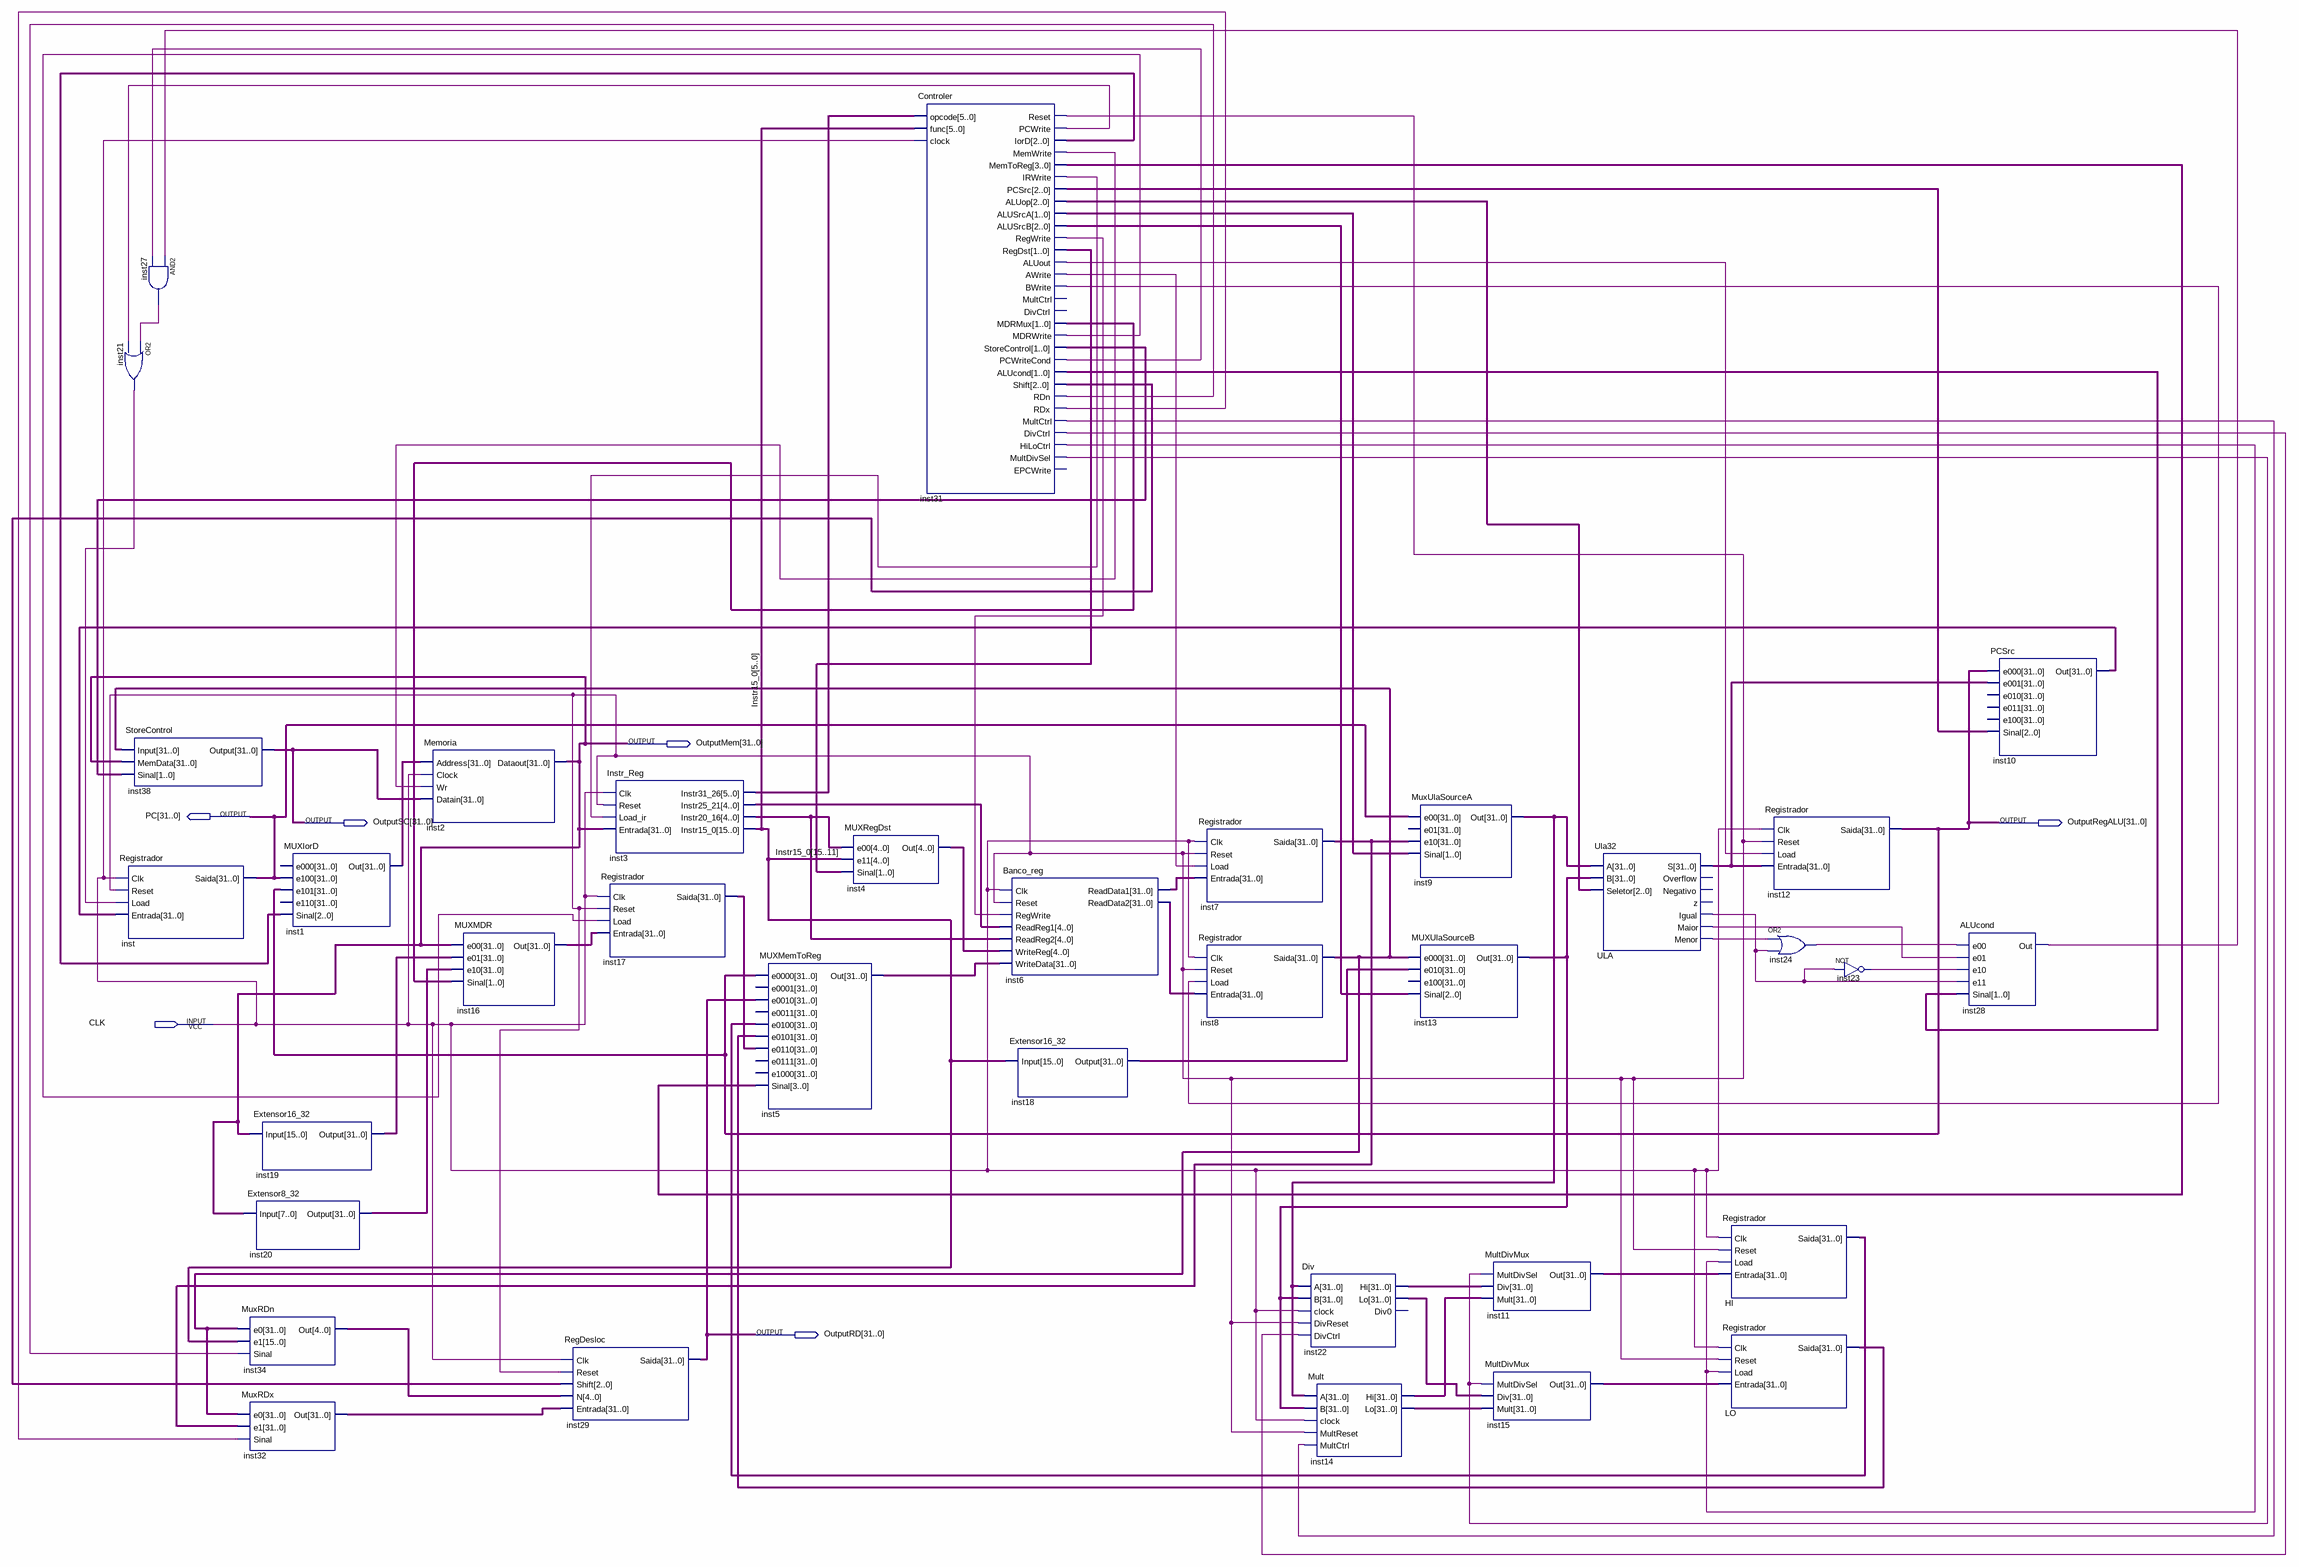
[diagram p0: schematic sheet]
// Quartus schematic HW.bdf as structural Verilog: 35 symbols, 6 pins
module HW (
  input  CLK,
  output [31:0] OutputMem,
  output [31:0] PC,
  output [31:0] OutputSC,
  output [31:0] OutputRegALU,
  output [31:0] OutputRD
);

  wire inst21_out, inst23_out, inst24_out, inst27_out, inst28_out, inst31_aluout, inst31_awrite,
       inst31_bwrite, inst31_divctrl, inst31_hiloctrl, inst31_irwrite, inst31_mdrwrite, inst31_memwrite,
       inst31_multctrl, inst31_multdivsel, inst31_pcwrite, inst31_pcwritecond, inst31_rdn, inst31_rdx,
       inst31_regwrite, inst31_reset, ULA_igual, ULA_maior, ULA_menor;
  wire [1:0] inst31_alucond, inst31_alusrca, inst31_mdrmux, inst31_regdst, inst31_storecontrol;
  wire [2:0] inst31_aluop, inst31_alusrcb, inst31_iord, inst31_pcsrc, inst31_shift;
  wire [3:0] inst31_memtoreg;
  wire [4:0] inst3_instr20_16, inst3_instr25_21, inst4_out, inst34_out;
  wire [5:0] inst3_instr31_26;
  wire [15:0] Instr15_0;
  wire [31:0] HI_saida, inst1_out, inst5_out, inst6_readdata1, inst6_readdata2, inst7_saida, inst8_saida,
       inst9_out, inst10_out, inst11_out, inst13_out, inst14_hi, inst14_lo, inst15_out, inst16_out,
       inst17_saida, inst18_output, inst19_output, inst20_output, inst22_hi, inst22_lo, inst32_out, LO_saida,
       ULA_s;

  or inst21 (inst21_out, inst27_out, inst31_pcwrite);
  Registrador inst (.Clk(CLK), .Reset(inst31_reset), .Load(inst21_out), .Entrada(inst10_out), .Saida(PC));
  and inst27 (inst27_out, inst28_out, inst31_pcwritecond);
  StoreControl inst38 (.Input(inst8_saida), .MemData(OutputMem), .Sinal(inst31_storecontrol), .Output(OutputSC));
  Extensor16_32 inst19 (.Input(OutputMem[15:0]), .Output(inst19_output));
  Extensor8_32 inst20 (.Input(OutputMem[7:0]), .Output(inst20_output));
  MuxRDn inst34 (.e0(inst8_saida), .e1(Instr15_0), .Sinal(inst31_rdn), .Out(inst34_out));
  MuxRDx inst32 (.e0(inst8_saida), .e1(inst7_saida), .Sinal(inst31_rdx), .Out(inst32_out));
  MUXIorD inst1 (.e100(PC), .e101(OutputRegALU), .Sinal(inst31_iord), .Out(inst1_out));  // open: e000, e110
  Memoria inst2 (.Address(inst1_out), .Clock(CLK), .Wr(inst31_memwrite), .Datain(OutputSC), .Dataout(OutputMem));
  MUXMDR inst16 (.e00(OutputMem), .e01(inst19_output), .e10(inst20_output), .Sinal(inst31_mdrmux), .Out(inst16_out));
  Instr_Reg inst3 (
    .Clk(CLK), .Reset(inst31_reset), .Load_ir(inst31_irwrite), .Entrada(OutputMem),
    .Instr31_26(inst3_instr31_26), .Instr25_21(inst3_instr25_21), .Instr20_16(inst3_instr20_16),
    .Instr15_0(Instr15_0));
  Registrador inst17 (
    .Clk(CLK), .Reset(inst31_reset), .Load(inst31_mdrwrite), .Entrada(inst16_out), .Saida(inst17_saida));
  RegDesloc inst29 (
    .Clk(CLK), .Reset(inst31_reset), .Shift(inst31_shift), .N(inst34_out), .Entrada(inst32_out),
    .Saida(OutputRD));
  MUXMemToReg inst5 (
    .e0000(OutputRegALU), .e0010(OutputRD), .e0100(HI_saida), .e0101(LO_saida), .e0110(inst17_saida),
    .Sinal(inst31_memtoreg), .Out(inst5_out));  // open: e0001, e0011, e0111, e1000
  MUXRegDst inst4 (.e00(inst3_instr20_16), .e11(Instr15_0[15:11]), .Sinal(inst31_regdst), .Out(inst4_out));
  Controler inst31 (
    .opcode(inst3_instr31_26), .func(Instr15_0[5:0]), .clock(CLK), .Reset(inst31_reset),
    .PCWrite(inst31_pcwrite), .IorD(inst31_iord), .MemWrite(inst31_memwrite), .MemToReg(inst31_memtoreg),
    .IRWrite(inst31_irwrite), .PCSrc(inst31_pcsrc), .ALUop(inst31_aluop), .ALUSrcA(inst31_alusrca),
    .ALUSrcB(inst31_alusrcb), .RegWrite(inst31_regwrite), .RegDst(inst31_regdst), .ALUout(inst31_aluout),
    .AWrite(inst31_awrite), .BWrite(inst31_bwrite), .MultCtrl({1'bz, inst31_multctrl}),
    .DivCtrl({1'bz, inst31_divctrl}), .MDRMux(inst31_mdrmux), .MDRWrite(inst31_mdrwrite),
    .StoreControl(inst31_storecontrol), .PCWriteCond(inst31_pcwritecond), .ALUcond(inst31_alucond),
    .Shift(inst31_shift), .RDn(inst31_rdn), .RDx(inst31_rdx), .HiLoCtrl(inst31_hiloctrl),
    .MultDivSel(inst31_multdivsel));  // open: EPCWrite
  Banco_reg inst6 (
    .Clk(CLK), .Reset(inst31_reset), .RegWrite(inst31_regwrite), .ReadReg1(inst3_instr25_21),
    .ReadReg2(inst3_instr20_16), .WriteReg(inst4_out), .WriteData(inst5_out), .ReadData1(inst6_readdata1),
    .ReadData2(inst6_readdata2));
  Extensor16_32 inst18 (.Input(Instr15_0), .Output(inst18_output));
  Registrador inst7 (
    .Clk(CLK), .Reset(inst31_reset), .Load(inst31_awrite), .Entrada(inst6_readdata1), .Saida(inst7_saida));
  Registrador inst8 (
    .Clk(CLK), .Reset(inst31_reset), .Load(inst31_bwrite), .Entrada(inst6_readdata2), .Saida(inst8_saida));
  Div inst22 (
    .A(inst9_out), .B(inst13_out), .clock(CLK), .DivReset(inst31_reset), .DivCtrl(inst31_divctrl),
    .Hi(inst22_hi), .Lo(inst22_lo));  // open: Div0
  Mult inst14 (
    .A(inst9_out), .B(inst13_out), .clock(CLK), .MultReset(inst31_reset), .MultCtrl(inst31_multctrl),
    .Hi(inst14_hi), .Lo(inst14_lo));
  MuxUlaSourceA inst9 (.e00(PC), .e10(inst7_saida), .Sinal(inst31_alusrca), .Out(inst9_out));  // open: e01
  MUXUlaSourceB inst13 (
    .e000(inst8_saida), .e010(inst18_output), .Sinal(inst31_alusrcb), .Out(inst13_out));  // open: e100
  MultDivMux inst11 (.MultDivSel(inst31_multdivsel), .Div(inst22_hi), .Mult(inst14_hi), .Out(inst11_out));
  MultDivMux inst15 (.MultDivSel(inst31_multdivsel), .Div(inst22_lo), .Mult(inst14_lo), .Out(inst15_out));
  Ula32 ULA (
    .A(inst9_out), .B(inst13_out), .Seletor(inst31_aluop), .S(ULA_s), .Igual(ULA_igual), .Maior(ULA_maior),
    .Menor(ULA_menor));  // open: Overflow, Negativo, z
  Registrador HI (.Clk(CLK), .Reset(inst31_reset), .Load(inst31_hiloctrl), .Entrada(inst11_out), .Saida(HI_saida));
  Registrador LO (.Clk(CLK), .Reset(inst31_reset), .Load(inst31_hiloctrl), .Entrada(inst15_out), .Saida(LO_saida));
  Registrador inst12 (.Clk(CLK), .Reset(inst31_reset), .Load(inst31_aluout), .Entrada(ULA_s), .Saida(OutputRegALU));
  or inst24 (inst24_out, ULA_menor, ULA_igual);
  not inst23 (inst23_out, ULA_igual);
  ALUcond inst28 (
    .e00(inst24_out), .e01(ULA_maior), .e10(inst23_out), .e11(ULA_igual), .Sinal(inst31_alucond),
    .Out(inst28_out));
  PCSrc inst10 (.e000(OutputRegALU), .e001(ULA_s), .Sinal(inst31_pcsrc), .Out(inst10_out));  // open: e010, e011, e100

  // Other names for the same wires on the sheet: Dataout[31:0] = OutputMem
endmodule
